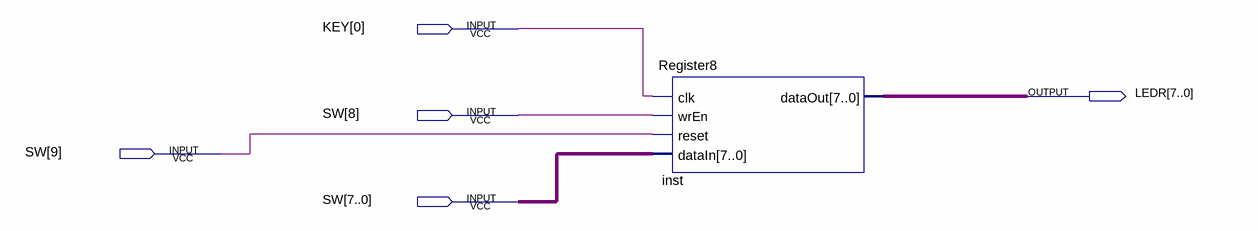
[diagram p0: schematic sheet]
// Quartus schematic Register_Demo.bdf as structural Verilog: 1 symbols, 5 pins
module Register_Demo (
  input  [0:0] KEY,
  input  [9:0] SW,
  output [7:0] LEDR
);

  Register8 inst (.clk(KEY[0]), .wrEn(SW[8]), .reset(SW[9]), .dataIn(SW[7:0]), .dataOut(LEDR));
endmodule
